# Altium schematic sheet NCD_SHEET.SchDoc
size A4
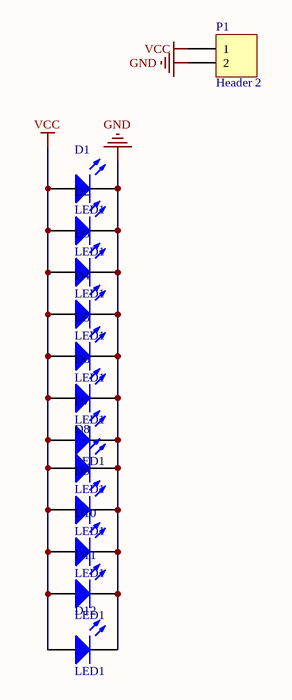
[diagram p0: NCD_SHEET.SchDoc]

## Parts
D1  LED1  [0603]
D2  LED1  [0603]
D3  LED1  [0603]
D4  LED1  [0603]
D5  LED1  [0603]
D6  LED1  [0603]
D7  LED1  [0603]
D8  LED1  [0603]
D9  LED1  [0603]
D10  LED1  [0603]
D11  LED1  [0603]
D12  LED1  [0603]
P1  Header 2  [HDR1X2]

## Nets
GND: D1.2(K) D2.2(K) D3.2(K) D4.2(K) D5.2(K) D6.2(K) D7.2(K) D8.2(K) D9.2(K) D10.2(K) D11.2(K) D12.2(K) P1.2
VCC: D1.1(A) D2.1(A) D3.1(A) D4.1(A) D5.1(A) D6.1(A) D7.1(A) D8.1(A) D9.1(A) D10.1(A) D11.1(A) D12.1(A) P1.1

## Library data of the parts
D1-D12 = LED1: Typical RED GaAs LED; Published: 8-Jun-2000; LatestRevisionDate: 08-Jul-2005; LatestRevisionNote: Mech Layer 1 removed.; PackageReference: LED-1; Publisher: Altium Limited; PackageDescription: LED; 2 Leads
P1 = Header 2: Header, 2-Pin; LatestRevisionDate: 17-Jul-2002; LatestRevisionNote: Re-released for DXP Platform.; Publisher: Altium Limited